# EAGLE design controller (EAGLE 8.6.0)
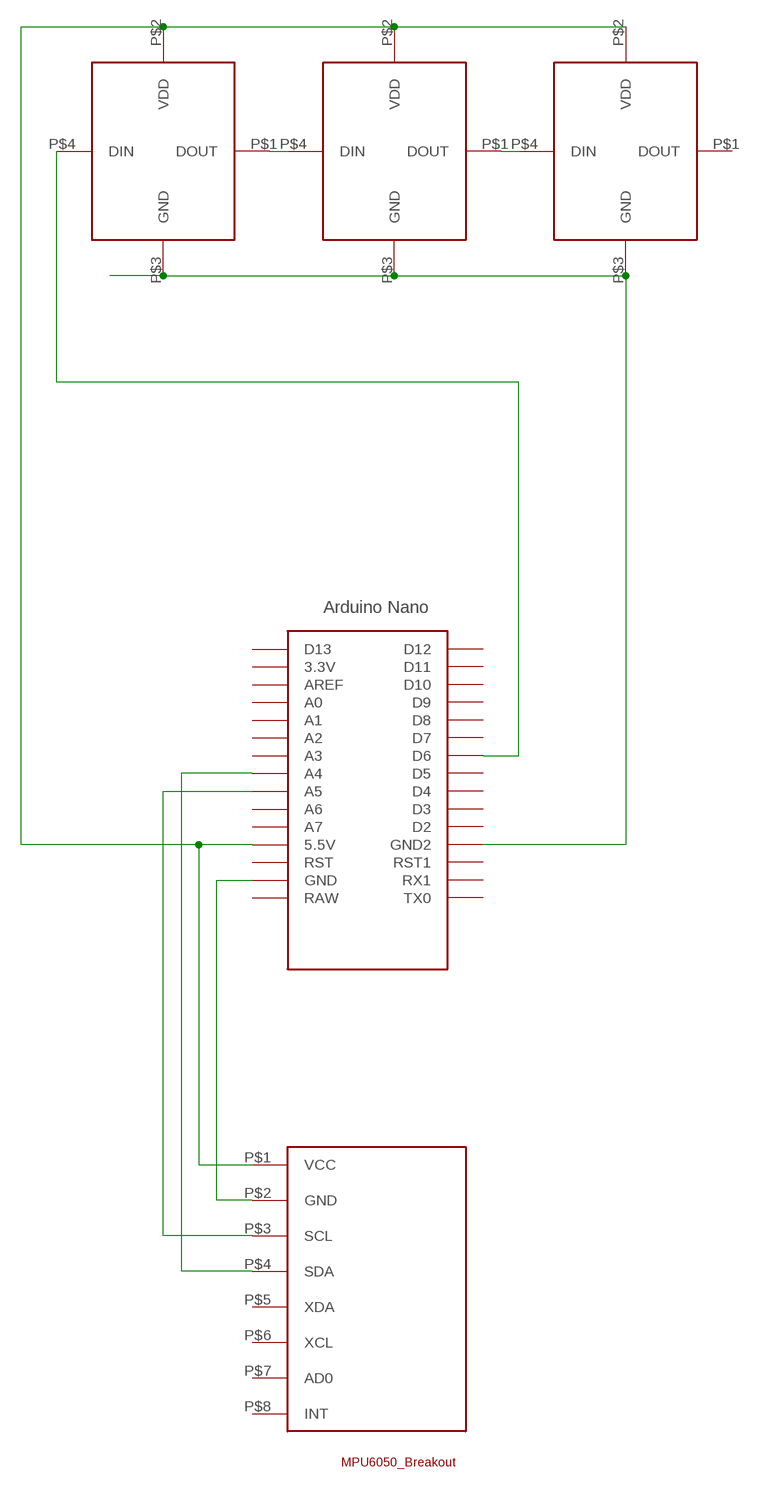
[diagram p0: schematic, sheet 1]

## Parts
U$1  NANO  [NANO]
U$2  NEOPIXEL_8MM  [NEOPIXEL_8MM]
U$3  NEOPIXEL_8MM  [NEOPIXEL_8MM]
U$4  NEOPIXEL_8MM  [NEOPIXEL_8MM]
U$5  MPU6050_BREAKOUT  [MPU6050]

## Nets
N$1: U$1.5V(5.5V) U$2.P$2(VDD) U$3.P$2(VDD) U$4.P$2(VDD) U$5.P$1(VCC)
N$2: U$1.GND U$5.P$2(GND)
N$3: U$1.A4 U$5.P$4(SDA)
N$4: U$1.A5 U$5.P$3(SCL)
N$5: U$1.D6 U$2.P$4(DIN)
N$7: U$1.GND1(GND2) U$2.P$3(GND) U$3.P$3(GND) U$4.P$3(GND)
N$8: U$2.P$1(DOUT) U$3.P$4(DIN)
N$9: U$3.P$1(DOUT) U$4.P$4(DIN)
Unconnected: U$1.3.3V U$1.A0 U$1.A1 U$1.A2 U$1.A3 U$1.A6 U$1.A7 U$1.AREF U$1.D2 U$1.D3 U$1.D4 U$1.D5 U$1.D7 U$1.D8 U$1.D9 U$1.D10 U$1.D11 U$1.D12 U$1.D13 U$1.ICSP1 U$1.ICSP2 U$1.ICSP3 U$1.ICSP4 U$1.ICSP5 U$1.ICSP6 U$1.RAW U$1.RST U$1.RST1 U$1.RX1 U$1.TX0 U$4.P$1(DOUT) U$5.P$5(XDA) U$5.P$6(XCL) U$5.P$7(AD0) U$5.P$8(INT)

## Library data of the parts
U$1 = mayfes2018_vr:NANO: Arduino Nano
U$2-U$4 = mayfes2018_vr:NEOPIXEL_8MM
U$5 = mayfes2018_vr:MPU6050_BREAKOUT

## Board
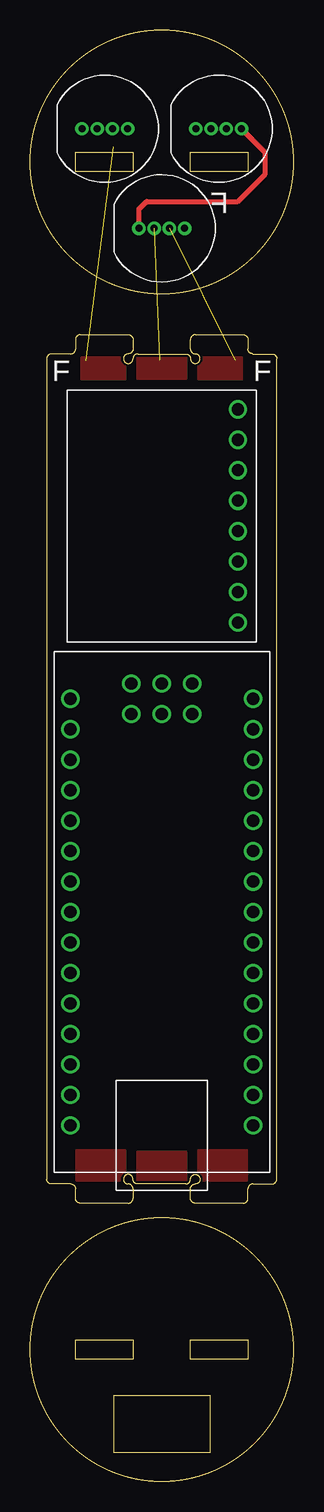
[diagram p1: board, top side]
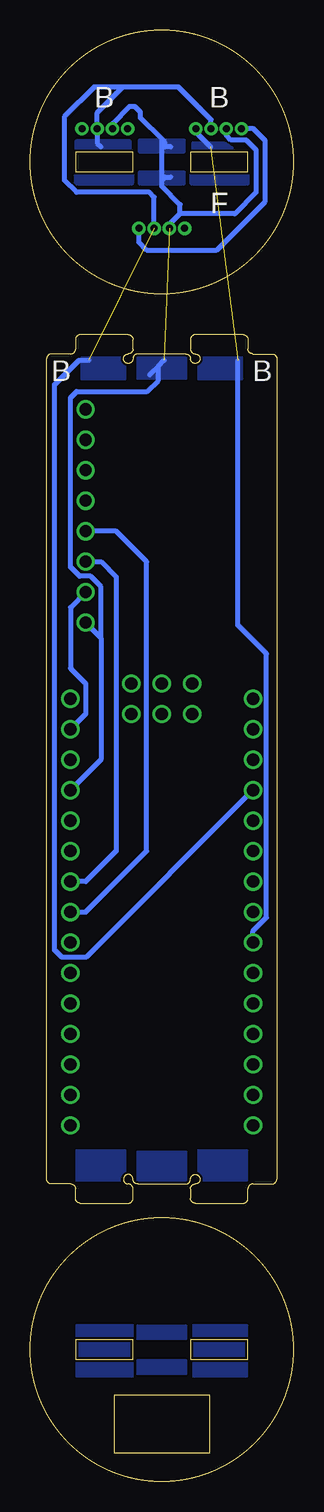
[diagram p2: board, bottom side, seen from below]

Size 22 x 121 mm. Coordinates in mm from the lower left corner, seen from the top.
Outline: 13.4,24.4 13.4,23.6 arc90 13.8,23.2 17.8,23.2 arc90 18.2,23.6 18.2,24.4 arc-90 18.6,24.8 20.2,24.8 arc90 20.6,25.2 20.6,93.6 arc90 20.2,94 18.6,94 arc-90 18.2,94.4 18.2,95.2 arc90 17.8,95.6 13.8,95.6 arc90 13.4,95.2 13.4,94.4 arc90 13.8,94 arc-270 13.4,93.6 arc90 13,94 9,94 arc90 8.6,93.6 arc-270 8.2,94 arc90 8.6,94.4 8.6,95.2 arc90 8.2,95.6 4.2,95.6 arc90 3.8,95.2 3.8,94.4 arc-90 3.4,94 1.8,94 arc90 1.4,93.6 1.4,25.2 arc90 1.8,24.8 3.4,24.8 arc-90 3.8,24.4 3.8,23.6 arc90 4.2,23.2 8.2,23.2 arc90 8.6,23.6 8.6,24.4 arc90 8.2,24.8 arc-270 8.6,25.2 arc90 9,24.8 13,24.8 arc90 13.4,25.2 arc-270 13.8,24.8 arc90 13.4,24.4
Outline: 18.2,110.8 18.2,109.2 13.4,109.2 13.4,110.8 18.2,110.8
Outline: 8.6,110.8 8.6,109.2 3.8,109.2 3.8,110.8 8.6,110.8
Outline: 18.2,11.8 18.2,10.2 13.4,10.2 13.4,11.8 18.2,11.8
Outline: 8.6,11.8 8.6,10.2 3.8,10.2 3.8,11.8 8.6,11.8
Outline: 7,7.2 15,7.2 15,2.4 7,2.4 7,7.2
Outline: circle at 11,110 radius 11
Outline: circle at 11,11 radius 11
Copper layers (1*16): Top 0.035mm / dielectric 1.5mm / Bottom 0.035mm
Design rules "default *": minimum track width 6mil, minimum drill 0.35mm, track to track 6mil, track to pad 6mil, pad to pad 6mil, via to via 6mil, smd to smd 6mil, copper to edge 0.2mm, drill to drill 6mil, minimum pad ring 10mil, minimum via ring 8mil, stop-mask expansion 4mil, vias tented up to drill 0mil, thermal gap 10mil

### Footprints (pad centres in the part's own frame; a part is rotated, then mirrored left to right if it is on the bottom)
NANO = drill 1.016: 3.3V -7.62,15.24; 5V -7.62,-10.16; A0 -7.62,10.16; A1 -7.62,7.62; A2 -7.62,5.08; A3 -7.62,2.54; A4 -7.62,0; A5 -7.62,-2.54; A6 -7.62,-5.08; A7 -7.62,-7.62; AREF -7.62,12.7; D2 7.62,-7.62; D3 7.62,-5.08; D4 7.62,-2.54; D5 7.62,0; D6 7.62,2.54; D7 7.62,5.08; D8 7.62,7.62; D9 7.62,10.16; D10 7.62,12.7; D11 7.62,15.24; D12 7.62,17.78; D13 -7.62,17.78; GND -7.62,-15.24; GND1 7.62,-10.16; ICSP1 -2.54,-19.05; ICSP2 -2.54,-16.51; ICSP3 0,-19.05; ICSP4 0,-16.51; ICSP5 2.54,-19.05; ICSP6 2.54,-16.51; RAW -7.62,-17.78; RST -7.62,-12.7; RST1 7.62,-12.7; RX1 7.62,-15.24; TX0 7.62,-17.78
NEOPIXEL_8MM = drill 0.6: P$1 -1.905,0; P$2 -0.635,0; P$3 0.635,0; P$4 1.905,0
MPU6050 = drill 1.016: P$1 -6.35,8.89; P$2 -6.35,6.35; P$3 -6.35,3.81; P$4 -6.35,1.27; P$5 -6.35,-1.27; P$6 -6.35,-3.81; P$7 -6.35,-6.35; P$8 -6.35,-8.89

### Placement (x,y rotation side)
U$1  11,47.47 180 top
U$2  6.25,112.77 0 top
U$3  11,104.47 0 top
U$4  15.75,112.77 0 top
U$5  11,80.49 180 top

### Tracks (layer width: path | path; a pad name or v marks a point on that pad's centre or on a via)
N$1  (1 unrouted)
  Bottom 0.406: U$5.P$1 16.08,70.33 | 16.08,70.33 16.08,60.17 U$1.5V | 16.08,70.33 16.08,74.59 16.95,75.46 17.86,75.46 18.62,76.23 18.62,90.35 18.11,90.86 12.22,90.86 11.29,91.79 11.29,92.98 | U$2.P$2 5.62,112.23 5.21,111.83 3.94,111.83 3.13,111.02 3.13,107.46 4.9,105.68 9.48,105.68 | U$4.P$2 15.12,113.2 13.71,114.61 13.23,114.61 12.78,114.15 12.78,113.66 11,111.88 | 10.24,111.27 10.75,111.27 10.75,111.63 11,111.88 | U$3.P$2 10.37,104.79 9.48,105.68 | 9.48,105.68 9.48,106.44 11,107.97 11,108.48 | 11,108.48 11,111.88 | 11,108.48 10.75,108.73 10.24,108.73 | 12.02,92.25 11.29,92.98 | 11.29,92.98 10.8,93.47
  pour Bottom: 9.22,111.78 9.22,110.89 12.78,110.89 12.78,111.78
  pour Bottom: 9.22,109.11 9.22,108.22 12.78,108.22 12.78,109.11
  pour Bottom: 8.97,93.7 13.03,93.7 13.03,91.93 8.97,91.93
N$2
  Bottom 0.406: U$5.P$2 18.62,72.87 18.62,67.79 17.35,66.52 17.35,63.98 U$1.GND
N$3
  Bottom 0.406: U$1.A4 17.35,47.47 12.27,52.55 12.27,76.68 14.81,79.22 U$5.P$4
N$4
  Bottom 0.406: U$5.P$3 16.08,76.68 14.81,75.41 14.81,52.55 17.35,50.01 U$1.A5
N$5  (1 unrouted)
  Bottom 0.406: U$2.P$4 8.15,112.49 6.94,111.27 | U$1.D6 3.38,45.89 2.26,47.01 2.26,69 4.65,71.39 4.65,93.42
  pour Bottom: 5.83,111.6 4.61,110.8 8.4,110.8 8.4,111.6
  pour Bottom: 4.29,93.7 4.29,91.89 7.96,91.89 7.96,93.7
N$6
  pour Bottom: 3.89,109.24 3.89,108.22 8.46,108.22 8.46,109.24
N$7  (1 unrouted)
  Bottom 0.406: U$2.P$3 6.88,113.53 9.58,116.23 14.25,116.23 | U$3.P$3 11.63,107.08 12.02,107.46 18.11,107.46 19.13,108.48 19.13,113.76 16.66,116.23 14.25,116.23 | 16.08,111.27 16.38,111.58 U$4.P$3 16.38,114.1 14.25,116.23 | U$1.GND1 17.32,43.69 19.33,43.69 19.94,44.3 19.94,91.44 17.91,93.47 17.1,93.47
  pour Bottom: 13.69,111.68 18.11,111.68 18.11,110.46 13.69,110.46
  pour Bottom: 14.04,93.7 14.04,91.89 17.71,91.89 17.71,93.7
N$8
  Bottom 0.406: U$3.P$4 12.9,103.3 12.27,102.66 6.4,102.66 2.36,106.7 2.36,111.78 3.35,112.77 U$2.P$1
N$9
  Top 0.406: U$3.P$1 9.1,106.06 9.73,106.7 17.35,106.7 19.64,108.98 19.64,110.79 U$4.P$4
N$10
  pour Bottom: 13.54,109.24 13.54,108.22 18.11,108.22 18.11,109.24
N$11
  pour Bottom: 13.03,25.1 8.97,25.1 8.97,27.47 13.03,27.47
N$12
  pour Bottom: 3.89,27.6 3.89,25.1 7.96,25.1 7.96,27.6
N$13
  pour Bottom: 14.04,27.6 14.04,25.1 18.11,25.1 18.11,27.6
N$14
  pour Bottom: 3.89,13.03 8.36,13.03 8.36,8.76 3.89,8.76
N$15
  pour Bottom: 8.97,13 13.03,13 13.03,11.9 8.97,11.9
N$16
  pour Bottom: 13.44,13.03 18.11,13.03 18.11,8.76 13.44,8.76
N$17
  pour Top: 13.03,93.7 8.97,93.7 8.97,91.93 13.03,91.93
N$18
  pour Top: 17.71,93.7 17.71,91.89 14.04,91.89 14.04,93.7
N$19
  pour Top: 7.96,93.7 7.96,91.89 4.29,91.89 4.29,93.7
N$20
  pour Top: 8.97,25.1 13.03,25.1 13.03,27.47 8.97,27.47
N$21
  pour Top: 18.11,27.6 18.11,25.1 14.04,25.1 14.04,27.6
N$22
  pour Top: 7.96,27.6 7.96,25.1 3.89,25.1 3.89,27.6
N$23
  pour Bottom: 8.97,10.1 13.03,10.1 13.03,9 8.97,9

### Text on the board
tNames: F | F | F
bNames: B | B | F | B | B